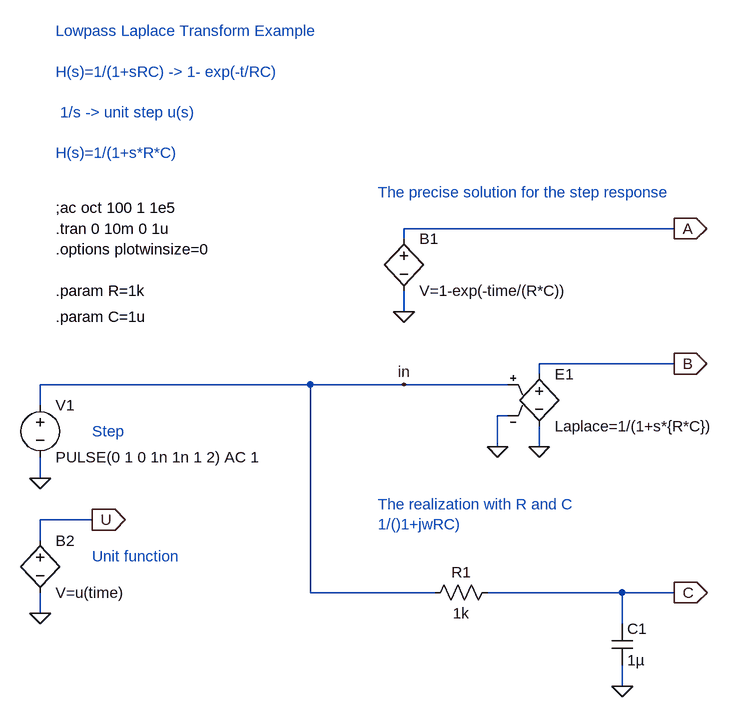
[diagram p0: schematic laplace2.asc]
laplace2.asc, the LTspice schematic file:
Version 4
SHEET 1 2040 1700
WIRE 288 352 288 320
WIRE 288 464 288 432
WIRE 288 560 288 528
WIRE 288 672 288 640
WIRE 368 528 288 528
WIRE 704 320 288 320
WIRE 704 640 704 320
WIRE 848 96 848 80
WIRE 848 208 848 176
WIRE 848 320 704 320
WIRE 896 640 704 640
WIRE 992 416 992 368
WIRE 1008 320 848 320
WIRE 1008 368 992 368
WIRE 1056 304 1056 288
WIRE 1056 416 1056 384
WIRE 1184 640 976 640
WIRE 1184 688 1184 640
WIRE 1184 784 1184 752
WIRE 1264 80 848 80
WIRE 1264 288 1056 288
WIRE 1264 640 1184 640
FLAG 288 464 0
FLAG 1264 288 B
IOPIN 1264 288 Out
FLAG 1056 416 0
FLAG 992 416 0
FLAG 1184 784 0
FLAG 1264 640 C
IOPIN 1264 640 Out
FLAG 1264 80 A
IOPIN 1264 80 Out
FLAG 848 208 0
FLAG 848 320 in
FLAG 288 672 0
FLAG 368 528 U
IOPIN 368 528 Out
SYMBOL VOLTAGE 288 336 R0
SYMATTR InstName V1
SYMATTR Value PULSE(0 1 0 1n 1n 1 2) AC 1
SYMBOL E 1056 288 R0
WINDOW 123 24 132 Left 0
SYMATTR InstName E1
SYMATTR Value Laplace=1/(1+s*{R*C})
SYMBOL res 880 656 R270
WINDOW 0 32 56 VTop 0
WINDOW 3 0 56 VBottom 0
SYMATTR InstName R1
SYMATTR Value 1k
SYMBOL cap 1168 688 R0
SYMATTR InstName C1
SYMATTR Value 1µ
SYMBOL bv 848 80 R0
SYMATTR InstName B1
SYMATTR Value V=1-exp(-time/(R*C))
SYMBOL bv 288 544 R0
SYMATTR InstName B2
SYMATTR Value V=u(time)
TEXT 312 48 Left 0 !;ac oct 100 1 1e5
TEXT 312 80 Left 0 !.tran 0 10m 0 1u
TEXT 808 504 Left 0 ;The realization with R and C\n1/()1+jwRC)
TEXT 808 24 Left 0 ;The precise solution for the step response
TEXT 312 -224 Left 0 ;Lowpass Laplace Transform Example\n \nH(s)=1/(1+sRC) -> 1- exp(-t/RC)\n \n 1/s -> unit step u(s)\n \nH(s)=1/(1+s*R*C)
TEXT 312 176 Left 0 !.param R=1k
TEXT 312 216 Left 0 !.param C=1u
TEXT 368 392 Left 0 ;Step
TEXT 312 112 Left 0 !.options plotwinsize=0
TEXT 368 584 Left 0 ;Unit function

The netlist it stands for:
* laplace2.asc
V1 in 0 PULSE(0 1 0 1n 1n 1 2) AC 1
E1 B 0 in 0 Laplace=1/(1+s*{R*C})
R1 in C 1k
C1 C 0 1µ
B1 A 0 V=1-exp(-time/(R*C))
B2 U 0 V=u(time)
;ac oct 100 1 1e5
.tran 0 10m 0 1u
* The realization with R and C
* 1/()1+jwRC)
* The precise solution for the step response
* Lowpass Laplace Transform Example
* H(s)=1/(1+sRC) -> 1- exp(-t/RC)
*  1/s -> unit step u(s)
* H(s)=1/(1+s*R*C)
.param R=1k
.param C=1u
* Step
.options plotwinsize=0
* Unit function
.backanno
.end